# EAGLE design USB_MINER_CH340_c (EAGLE 9.6.2)
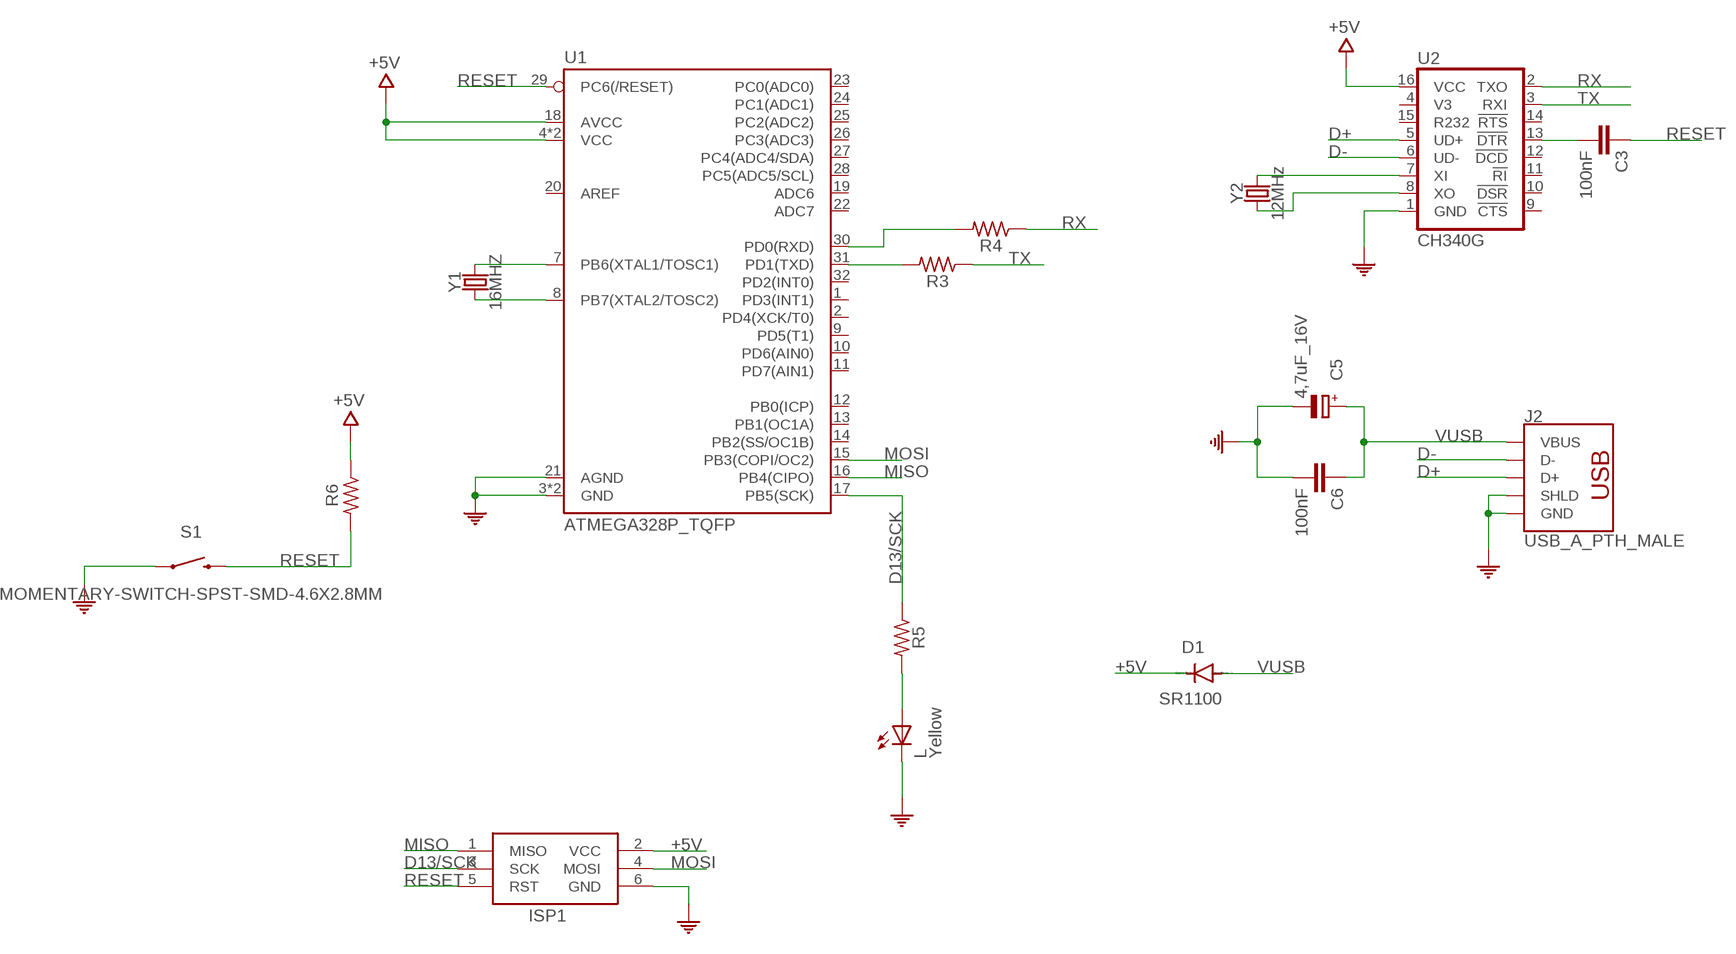
[diagram p0: schematic, sheet 1]

## Parts
C3  100nF  C-EUC0805K  [C0805K]
C5  4,7uF_16V  0833_TAJA475MO16RNJ  [TAN-A]
C6  100nF  C-EUC0805K  [C0805K]
D1  SR1100  DIODE-DO-214AC  [DO-214AC]
ISP1  AVRISP-6  [AVRISP]
J2  USB_A_PTH_MALE  [USB-A-H]
L  Yellow  0044_KPT-2012YC  [CHIPLED_0805]
R3  1k  R-US_R0805  [R0805]
R4  1k  R-US_R0805  [R0805]
R5  1k  R-US_R0805  [R0805]
R6  1k  R-US_R0805  [R0805]
S1  MOMENTARY-SWITCH-SPST-SMD-4.6X2.8MM  [TACTILE_SWITCH_SMD_4.6X2.8MM]
U1  ATMEGA328P_TQFP  [TQFP32-08]
U2  CH340G  CH340GSMD  [SO016]
Y1  16MHZ  CRYSTALSMD-HC49UP  [HC49UP]
Y2  12MHz  CRYSTALSMD-HC49UP  [HC49UP]

## Nets
+5V [Power]: D1.C ISP1.2(VCC) R6.1 U1.4(VCC) U1.6(VCC) U1.18(AVCC) U2.16(VCC)
COM [Power]: C5.2(-) C6.2 ISP1.6(GND) J2.GND J2.SHLD1(SHLD) J2.SHLD2(SHLD) L.C S1.1 S1.2 U1.3(GND) U1.5(GND) U1.21(AGND) U2.1(GND)
D13/SCK: ISP1.3(SCK) R5.1 U1.17(PB5(SCK))
D+: J2.D+ U2.5(UD+)
D-: J2.D- U2.6(UD-)
MISO: ISP1.1(MISO) U1.16(PB4(CIPO))
MOSI: ISP1.4(MOSI) U1.15(PB3(COPI/OC2))
N$1: U2.7(XI) Y2.2
N$2: U2.8(XO) Y2.1
N$3: U1.7(PB6(XTAL1/TOSC1)) Y1.2
N$7: L.A R5.2
N$10: U1.8(PB7(XTAL2/TOSC2)) Y1.1
N$12: R3.2 U1.31(PD1(TXD))
N$13: R4.2 U1.30(PD0(RXD))
N$14: C3.2 U2.13(!DTR)
RESET: C3.1 ISP1.5(RST) R6.2 S1.3 S1.4 U1.29(PC6(/RESET))
RX: R4.1 U2.2(TXO)
TX: R3.1 U2.3(RXI)
VUSB: C5.1(+) C6.1 D1.A J2.VBUS
Unconnected: U1.1(PD3(INT1)) U1.2(PD4(XCK/T0)) U1.9(PD5(T1)) U1.10(PD6(AIN0)) U1.11(PD7(AIN1)) U1.12(PB0(ICP)) U1.13(PB1(OC1A)) U1.14(PB2(SS/OC1B)) U1.19(ADC6) U1.20(AREF) U1.22(ADC7) U1.23(PC0(ADC0)) U1.24(PC1(ADC1)) U1.25(PC2(ADC2)) U1.26(PC3(ADC3)) U1.27(PC4(ADC4/SDA)) U1.28(PC5(ADC5/SCL)) U1.32(PD2(INT0)) U2.4(V3) U2.9(!CTS) U2.10(!DSR) U2.11(!RI) U2.12(!DCD) U2.14(!RTS) U2.15(R232)

## Library data of the parts
C3 C6 = rcl:C-EU: CAPACITOR, European symbol; SPICEPREFIX: C
C5 = Condensatori:0833_TAJA475MO16RNJ: 4,7uF; CASE: Case_A_(1206); MONTHLY_USAGE: _____; PART_NUMBER: TAJA475MO16RNJ; PRICE: _____; SUPPLIER: _____; TYPE: Condensatori
D1 = diode:DIODE-: DIODE
ISP1 = adafruit:AVRISP: AVR ISP HEADER Standard 6 pin header for AVR programming
J2 = SparkFun-Connectors:USB_A: USB-A Connector Male and female variants, as well as PTH and SMT variants SparkFun Products: SparkFun XBee Explorer Dongle <https://www.sparkfun.com/products/11697> PTH Male SparkFun MicroView-USB Programmer <https://www.sparkfun.com/products/12924> SMT Male SparkFun USB Type A Female Breakout <https://www.sparkfun.com/products/12700> SMT Female; PROD_ID: CONN-08367; SF_ID: PRT-00437
L = Opto:0044_KPT-2012YC: LED YELLOW - SMD - 0805; MONTHLY_USAGE: _____; PART_NUMBER: KPT-2012YC; PRICE: _____; SUPPLIER: _____; TYPE: Opto
R3-R6 = rcl:R-US_: RESISTOR, American symbol; SPICEPREFIX: R
S1 = SparkFun-Switches:MOMENTARY-SWITCH-SPST: Momentary Switch (Pushbutton) - SPST Normally-open (NO) SPST momentary switches (buttons, pushbuttons). Variants PTH-12MM - 12mm square, through-hole Momentary Pushbutton Switch - 12mm Square <https://www.sparkfun.com/products/9190> (COM-09190) PTH-6.0MM, PTH-6.0MM-KIT - 6.0mm square, through-hole Mini Pushbutton Switch <https://www.sparkfun.com/products/97> (COM-00097) KIT package intended for soldering kit's - only one side of pads' copper is exposed. PTH-RIGHT-ANGLE-KIT - Right-angle, through-hole Right Angle Tactile Button <https://www.sparkfun.com/products/10791> - Used on SparkFun BigTime Watch Kit <https://www.sparkfun.com/products/11734> SMD-12MM - 12mm square, surface-mount Tactile Button - SMD (12mm) <https://www.sparkfun.com/products/12993> (COM-12993) Used on SparkFun PicoBoard <https://www.sparkfun.com/products/11888> SMD-4.5MM - 4.5mm Square Trackball Switch Used on SparkFun Blackberry Trackballer Breakout <https://www.sparkfun.com/products/13169> SMD-4.6MMX2.8MM - 4.60mm x 2.80mm, surface mount Used on SparkFun Pro Micro - RP2040 <https://www.sparkfun.com/products/17717> SMD-5.2MM, SMD-5.2-REDUNDANT - 5.2mm square, surface-mount Mini Pushbutton Switch - SMD <https://www.sparkfun.com/products/8720> (COM-08720) Used on Arduino Pro Mini <https://www.sparkfun.com/products/11114> REDUNDANT package connects both switch circuits together SMD-6.0X3.5MM - 6.0 x 3.5mm, surface mount Momentary Reset Switch SMD <https://www.sparkfun.com/products/8229> (COM-08229) SMD-6.2MM-TALL - 6.2mm square, surface mount Tactile Button - SMD (6mm) <https://www.sparkfun.com/products/12992> Used on SparkFun Digital Sandbox <https://www.sparkfun.com/products/12651> SMD-RIGHT-ANGLE - Right-angle, surface mount Used on SparkFun Block for Intel® Edison - Arduino <https://www.sparkfun.com/products/13036>; PROD_ID: SWCH-15606
U1 = SparkFun-IC-Microcontroller:ATMEGA328P_TQFP: Popular 328P in QFP Storefront component: ATmega328 - TQFP <https://www.sparkfun.com/products/13448> (COM-13448) Datasheet <http://www.sparkfun.com/datasheets/Components/SMD/ATMega328.pdf> SparkFun Products SparkFun RedBoard - Programmed with Arduino <https://www.sparkfun.com/products/12757> (DEV-12757) Arduino Pro Mini 328 - 5V/16MHz <https://www.sparkfun.com/products/11113> (DEV-11113) Arduino Pro Mini 328 - 3.3V/8MHz <https://www.sparkfun.com/products/11114> (DEV-11114) SparkFun OpenLog <https://www.sparkfun.com/products/13712> (DEV-13712) SparkFun MicroView - OLED Arduino Module <https://www.sparkfun.com/products/12923> (DEV-12923) SparkFun Digital Sandbox <https://www.sparkfun.com/products/12651> (DEV-12651) SparkFun PicoBoard <https://www.sparkfun.com/products/11888> (WIG-11888) Arduino Fio <https://www.sparkfun.com/products/10116> (DEV-10116) LilyPad Arduino 328 Main Board <https://www.sparkfun.com/products/13342> (DEV-13342) SparkFun RedStick <https://www.sparkfun.com/products/13741> (DEV-13741) LilyPad MP3 <https://www.sparkfun.com/products/11013> (DEV-11013) LilyPad Arduino SimpleSnap <https://www.sparkfun.com/products/10941> (DEV-10941) SparkFun Stepoko <https://www.sparkfun.com/products/13899> (ROB-13899) SparkFun Geiger Counter <https://www.sparkfun.com/products/11345> (SEN-11345) SparkFun EL Sequencer <https://www.sparkfun.com/products/12781> (COM-12781) Arduino Pro 328 - 5V/16MHz <https://www.sparkfun.com/products/10915> (DEV-10915) CryptoCape <https://www.sparkfun.com/products/12773> (DEV-12773) SparkFun IR Thermometer Evaluation Board - MLX90614 <https://www.sparkfun.com/products/10740> (SEN-10740) SparkFun RedBot Mainboard <https://www.sparkfun.com/products/12097> (ROB-12097) Arduino Pro 328 - 3.3V/8MHz <https://www.sparkfun.com/products/10914> (DEV-10914) SparkFun Block for Intel® Edison - Arduino <https://www.sparkfun.com/products/13036> (DEV-13036) SparkFun Simon Says - Surface Mount Soldering Kit <https://www.sparkfun.com/products/10935> (KIT-10935) SparkFun 7-Segment Serial Display - Red <https://www.sparkfun.com/products/11441> (COM-11441) SparkFun 7-Segment Serial Display - White <https://www.sparkfun.com/products/11629> (COM-11629) SparkFun 7-Segment Serial Display - Yellow <https://www.sparkfun.com/products/11443> (COM-11443) SparkFun 7-Segment Serial Display - Kelly Green <https://www.sparkfun.com/products/11440> (COM-11440) SparkFun 7-Segment Serial Display - Blue <https://www.sparkfun.com/products/11442> (COM-11442) SparkFun OpenSegment Serial Display - 20mm (Blue) <https://www.sparkfun.com/products/11647> (COM-11647) SparkFun OpenSegment Serial Display - 20mm (Green) <https://www.sparkfun.com/products/11646> (COM-11646) SparkFun OpenSegment Serial Display - 20mm (White) <https://www.sparkfun.com/products/11648> (COM-11648) SparkFun OpenSegment Serial Display - 20mm (Red) <https://www.sparkfun.com/products/11644> (COM-11644) SparkFun OpenSegment Serial Display - 20mm (Yellow) <https://www.sparkfun.com/products/11645> (COM-11645) SparkFun OpenSegment Shield <https://www.sparkfun.com/products/13190> (DEV-13190); PROD_ID: IC-09069
U2 = SparkFun-IC-Comms:CH340G: A simple USB 2.0 to Serial IC.; PROD_ID: IC-13498
Y1 Y2 = SparkFun-Clocks:CRYSTAL: Crystals (Generic) These are passive quartz crystals, which can be used as a clock source for a microcontroller. Crystal's are two-terminal devices. They require external "load" capacitors to generate an oscillating signal.

## Net classes
0 default: clearance 0.406 mm
1 Power: width 0.508 mm, clearance 0.406 mm
2 signal: width 0.406 mm, clearance 0.406 mm

## Board
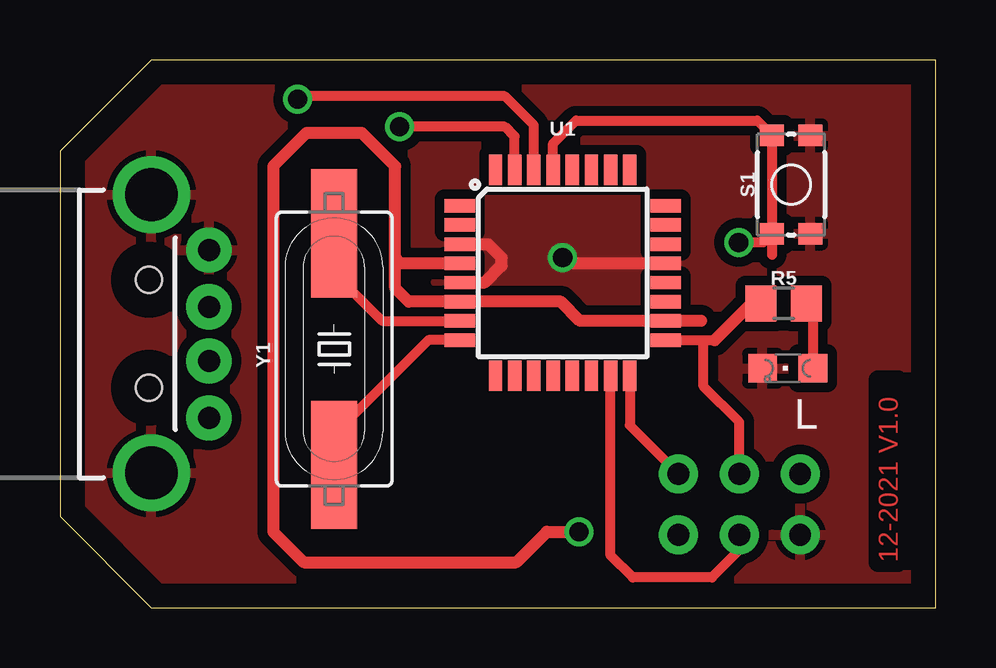
[diagram p1: board, top side]
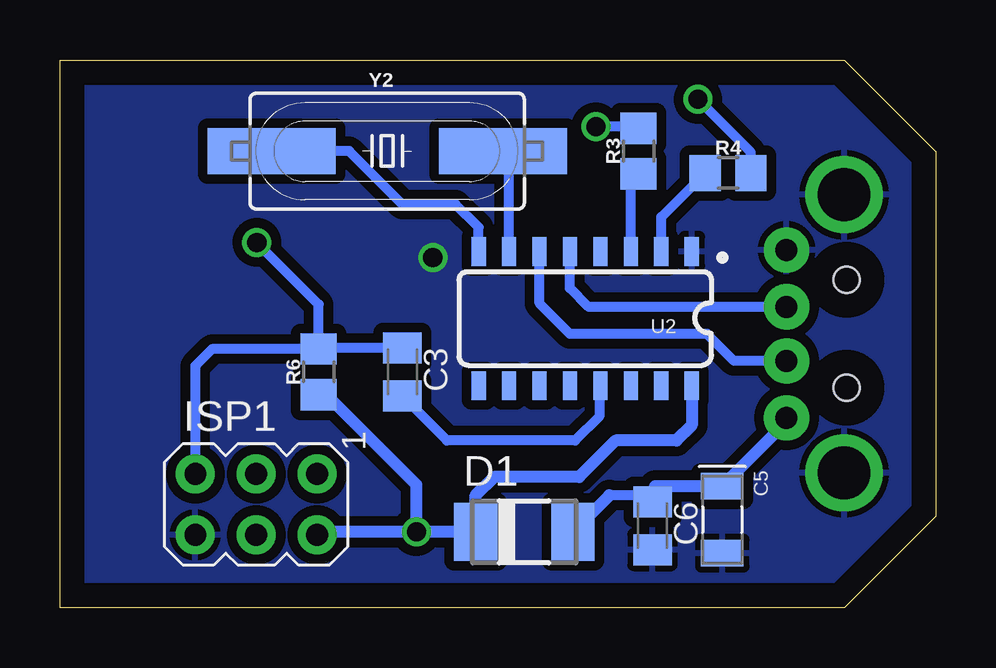
[diagram p2: board, bottom side, seen from below]

Size 36.5 x 22.85 mm. Coordinates in mm from the lower left corner, seen from the top.
Outline: 3.81,0 36.5,0 36.5,22.85 3.81,22.85 0.01,19.05 0,19.05 0,3.81 3.81,0
Copper layers (1*16): Top 0.035mm / dielectric 1.5mm / Bottom 0.035mm
Design rules "default": minimum track width 6mil, minimum drill 0.35mm, track to track 6mil, track to pad 6mil, pad to pad 6mil, via to via 6mil, smd to smd 6mil, copper to edge 40mil, drill to drill 6mil, minimum pad ring 10mil, minimum via ring 8mil, stop-mask expansion 4mil, vias tented up to drill 0mil, thermal gap 10mil

### Footprints (pad centres in the part's own frame; a part is rotated, then mirrored left to right if it is on the bottom)
C0805K = smd 1.3 x 1.6: 1 -1,0; 2 1,0
TAN-A = smd 1.118 x 1.778: 1 0,0; 2 2.794,0
DO-214AC = smd 1.8 x 2.4: A 2.025,0; C -2.025,0
AVRISP = drill 0.9 pad 1.626: 1 -1.27,2.54; 2 1.27,2.54; 3 -1.27,0; 4 1.27,0; 5 -1.27,-2.54; 6 1.27,-2.54
USB-A-H = drill 0.914 pad 1.88: D+ 2.4,1.127; D- 2.4,-1.127; GND 2.4,3.5; VBUS 2.4,-3.5 | drill 2.2: SHLD1 0,-5.8; SHLD2 0,5.8 | hole 1.1: -0.1,2.25; -0.1,-2.25
CHIPLED_0805 = smd 1.2 x 1.2: A 0,-1.05; C 0,1.05
R0805 = smd 1.3 x 1.5: 1 -0.95,0; 2 0.95,0
TACTILE_SWITCH_SMD_4.6X2.8MM = smd 0.9 x 1: 1 -2.05,-0.8; 2 2.05,-0.8; 3 2.05,0.8; 4 -2.05,0.8
TQFP32-08 = smd 1.27 x 0.559: 1 -4.293,2.8; 2 -4.293,2; 3 -4.293,1.2; 4 -4.293,0.4; 5 -4.293,-0.4; 6 -4.293,-1.2; 7 -4.293,-2; 8 -4.293,-2.8; 17 4.293,-2.8; 18 4.293,-2; 19 4.293,-1.2; 20 4.293,-0.4; 21 4.293,0.4; 22 4.293,1.2; 23 4.293,2; 24 4.293,2.8 | smd 0.559 x 1.27: 9 -2.8,-4.293; 10 -2,-4.293; 11 -1.2,-4.293; 12 -0.4,-4.293; 13 0.4,-4.293; 14 1.2,-4.293; 15 2,-4.293; 16 2.8,-4.293; 25 2.8,4.293; 26 2,4.293; 27 1.2,4.293; 28 0.4,4.293; 29 -0.4,4.293; 30 -1.2,4.293; 31 -2,4.293; 32 -2.8,4.293
SO016 = smd 0.6 x 1.2: 1 -4.445,-2.8; 2 -3.175,-2.8; 3 -1.905,-2.8; 4 -0.635,-2.8; 5 0.635,-2.8; 6 1.905,-2.8; 7 3.175,-2.8; 8 4.445,-2.8; 9 4.445,2.8; 10 3.175,2.8; 11 1.905,2.8; 12 0.635,2.8; 13 -0.635,2.8; 14 -1.905,2.8; 15 -3.175,2.8; 16 -4.445,2.8
HC49UP = smd 5.334 x 1.93: 1 -4.826,0; 2 4.826,0

### Placement (x,y rotation side)
C3  22.23,9.84 270 bottom
C5  8.89,5.08 270 bottom
C6  11.8,3.43 270 bottom
D1  17.14,3.17 0 bottom
ISP1  28.32,4.32 270 bottom
J2  3.81,11.43 0 top
L  30.34,9.99 90 top
R3  12.38,19.05 90 bottom
R4  8.65,18.14 0 bottom
R5  30.16,12.7 0 top
R6  25.72,9.85 90 bottom
S1  30.48,17.65 90 top
U1  20.95,13.97 0 top
U2  14.61,12.06 180 bottom
Y1  11.43,10.79 90 top
Y2  22.86,19.05 0 bottom

### Tracks (layer width: path | path; a pad name or v marks a point on that pad's centre or on a via)
+5V  (via drill 0.8)
  Top 0.508: 26.73,11.98 25.26,11.98 U1.18 21.68,11.97 20.89,12.77 U1.6 14.54,12.77 13.97,13.34 13.97,14.61 | v21.64,3.17 20.3,3.17 19.02,1.91 10.16,1.91 8.89,3.17 8.89,18.41 10.29,19.81 12.57,19.81 13.97,18.41 13.97,14.61 | U1.4 14.21,14.37 13.97,14.61
  Bottom 0.508: U2.16 10.16,7.62 10.79,6.99 13.34,6.99 14.86,5.46 18.41,5.46 19.17,4.71 D1.C v21.64,3.17 | ISP1.2 25.65,3.17 v21.64,3.17 | v21.64,3.17 21.64,5.14 25.4,8.89 R6.1 25.41,8.89
COM  (via drill 0.8)
  Top 0.508: U1.3 17.85,15.17 18.41,14.61 18.41,14.27 17.71,13.57 U1.5 | U1.21 21.19,14.37 v20.95,14.61
  pour Bottom: -0.64,-0.64 38.73,-0.64 38.73,23.5 -0.64,23.5 -0.64,22.23
  pour Top: -0.64,22.86 -0.64,-0.64 38.73,-0.64 38.73,23.5 -0.64,23.5
D13/SCK
  Top 0.406: U1.17 26.83,11.17 | ISP1.3 28.32,7.75 26.83,9.24 26.83,11.17 | 26.83,11.17 27.3,11.17
  Top 0.508: 27.3,11.17 28.83,12.7 R5.1
D+
  Bottom 0.406: J2.D+ 14.46,12.56 15.24,13.34 U2.5
D-
  Bottom 0.406: J2.D- 8.4,10.3 9.53,11.43 15.24,11.43 16.51,12.7 U2.6
MISO
  Top 0.406: U1.16 23.75,7.61 ISP1.1
MOSI
  Top 0.406: ISP1.4 28.32,2.41 27.18,1.27 23.88,1.27 22.95,2.19 U1.15
N$1
  Bottom 0.406: U2.7 17.78,18.8 Y2.2
N$2
  Bottom 0.406: U2.8 19.05,15.88 20,16.83 22.23,16.83 24.45,19.05 Y2.1
N$3
  Top 0.406: U1.7 13.43,11.97 11.43,13.97 Y1.2
N$7
  Top 0.406: 31.03,12.81 R5.2 31.39,12.43 L.A
N$10
  Top 0.406: U1.8 15.36,11.17 11.43,7.24 Y1.1
N$12  (via drill 0.8)
  Top 0.406: U1.31 18.95,19.65 18.54,20.07 v14.16,20.07
  Bottom 0.406: R3.2 12.45,20.07 v14.16,20.07
N$13  (via drill 0.8)
  Top 0.406: U1.30 19.75,20.12 18.54,21.34 10.03,21.34 v9.91,21.21
  Bottom 0.406: R4.2 7.7,19 v9.91,21.21
N$14
  Bottom 0.406: U2.13 14.02,9.22 14.02,8 15.03,6.99 20.37,6.99 C3.2
RESET  (via drill 0.8)
  Top 0.406: U1.29 20.55,19.36 21.51,20.32 29.06,20.32 S1.3 | S1.3 S1.4 29.32,15.24 v28.3,15.24 | S1.3 29.68,14.73
  Bottom 0.406: C3.1 25.67,10.84 R6.2 | R6.2 30.16,10.79 30.86,10.1 ISP1.5 | v28.3,15.24 25.72,12.66 R6.2
RX
  Bottom 0.406: R4.1 11.43,16.31 U2.2
TX
  Bottom 0.406: U2.3 12.7,17.78 R3.1
VUSB
  Bottom 0.406: 13.6,4.7 12.07,4.7 C6.1 11.8,4.97 11.68,5.08
  Bottom 0.508: J2.VBUS 6.21,7.76 C5.1 11.68,5.08 | 13.6,4.7 D1.A

### Text on the board
Top: 12-2021 V1.0